# EAGLE design C128_Keyb_Test_SMD (EAGLE 9.6.2)
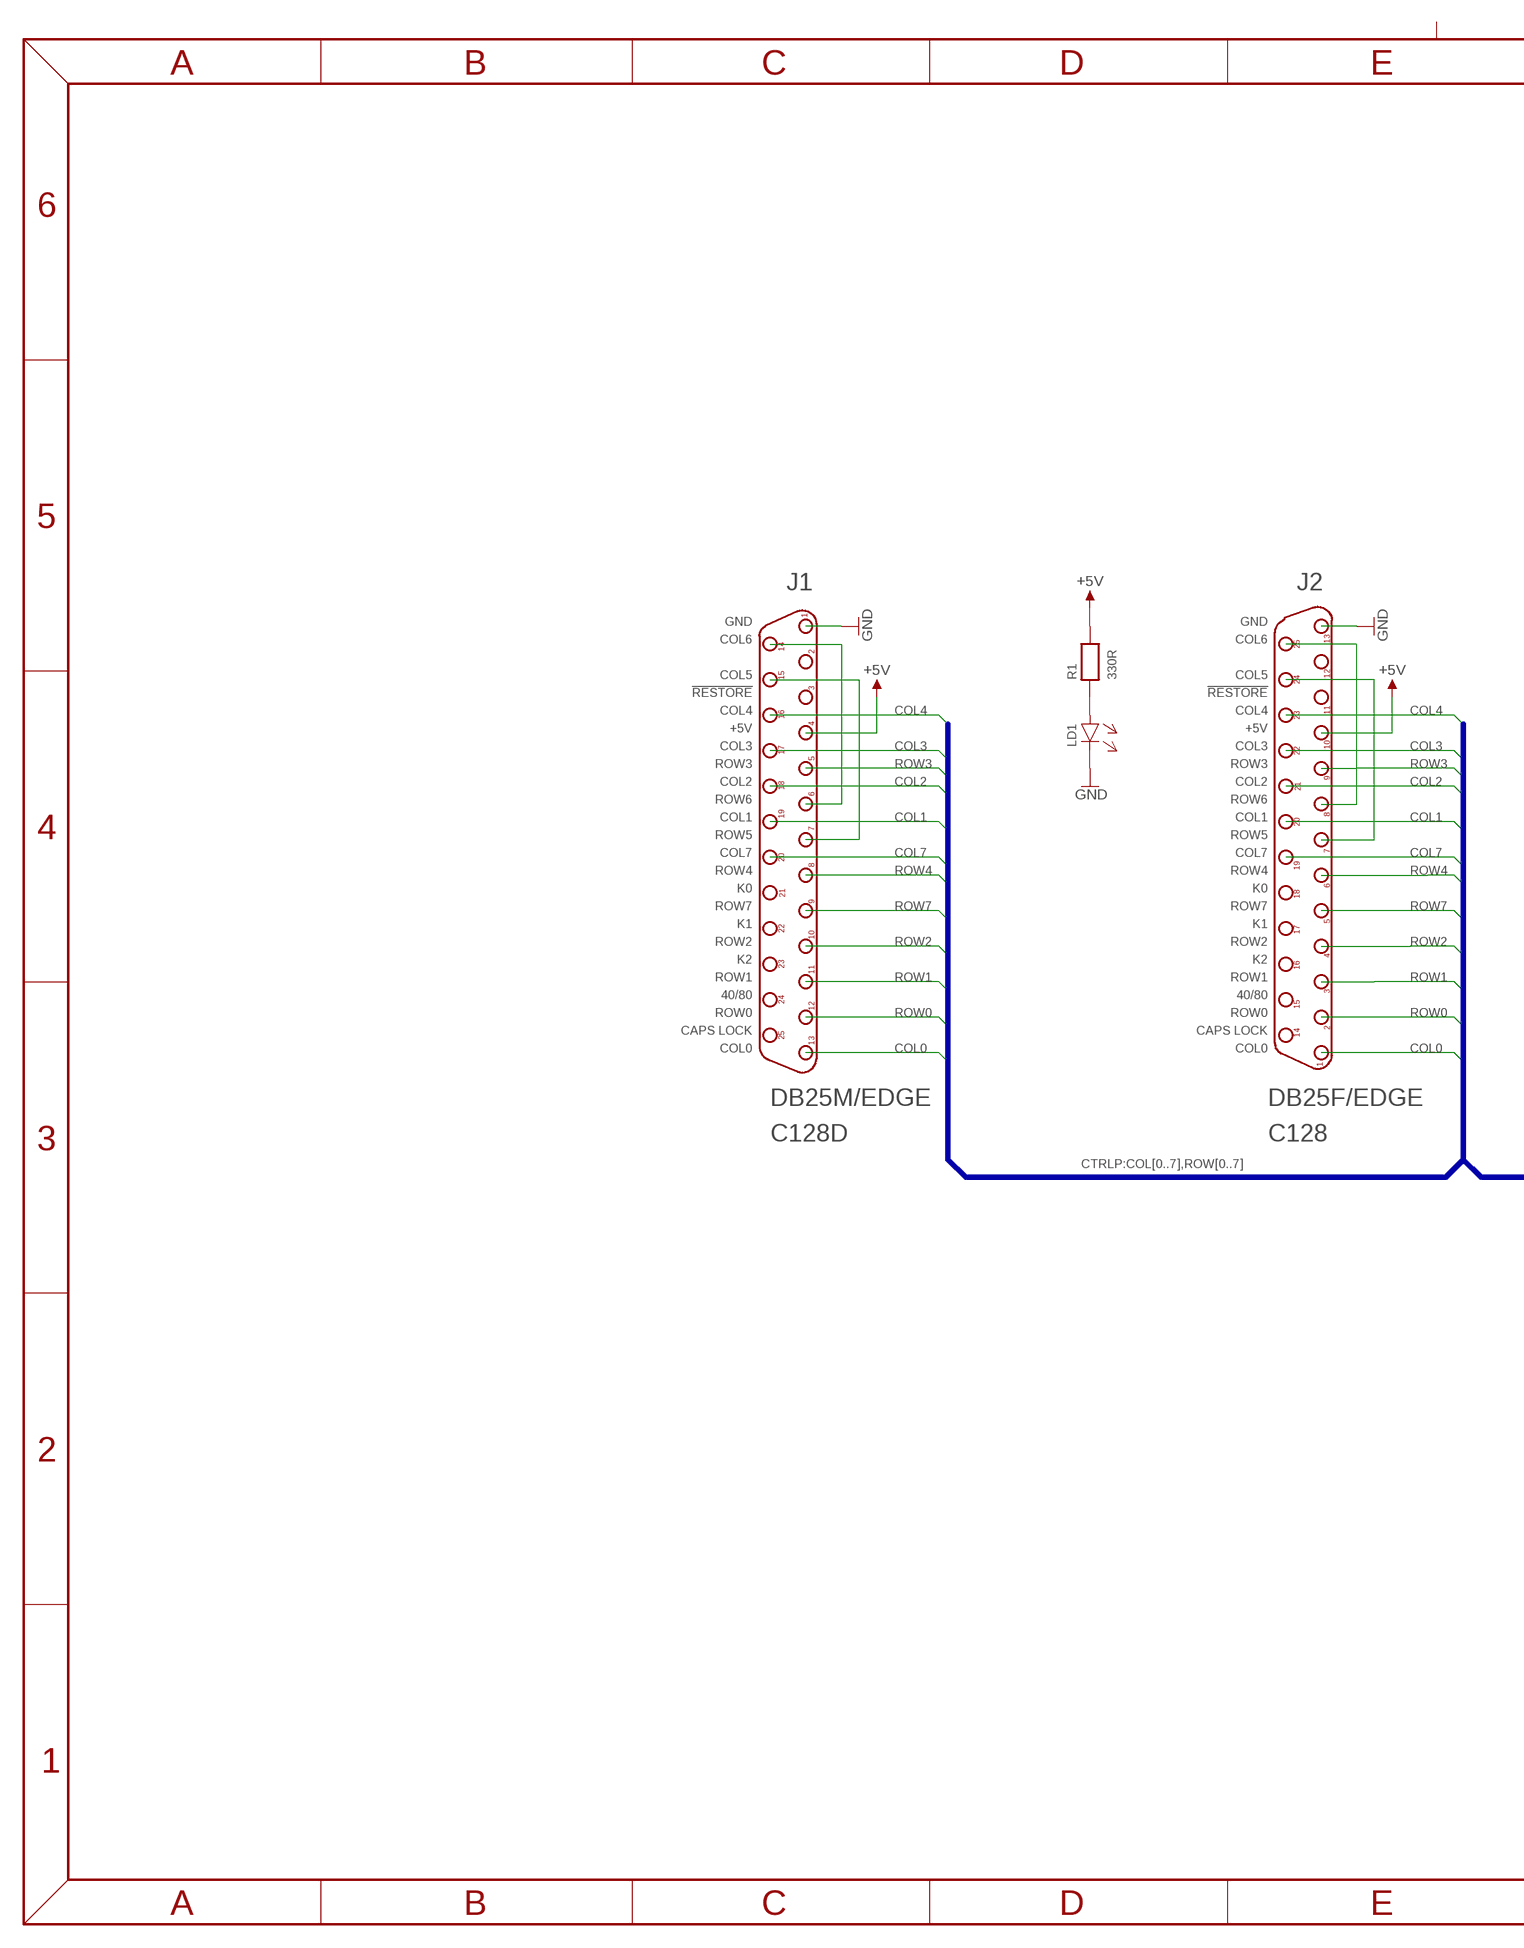
[diagram p0: schematic, sheet 1, part 1 of 2]
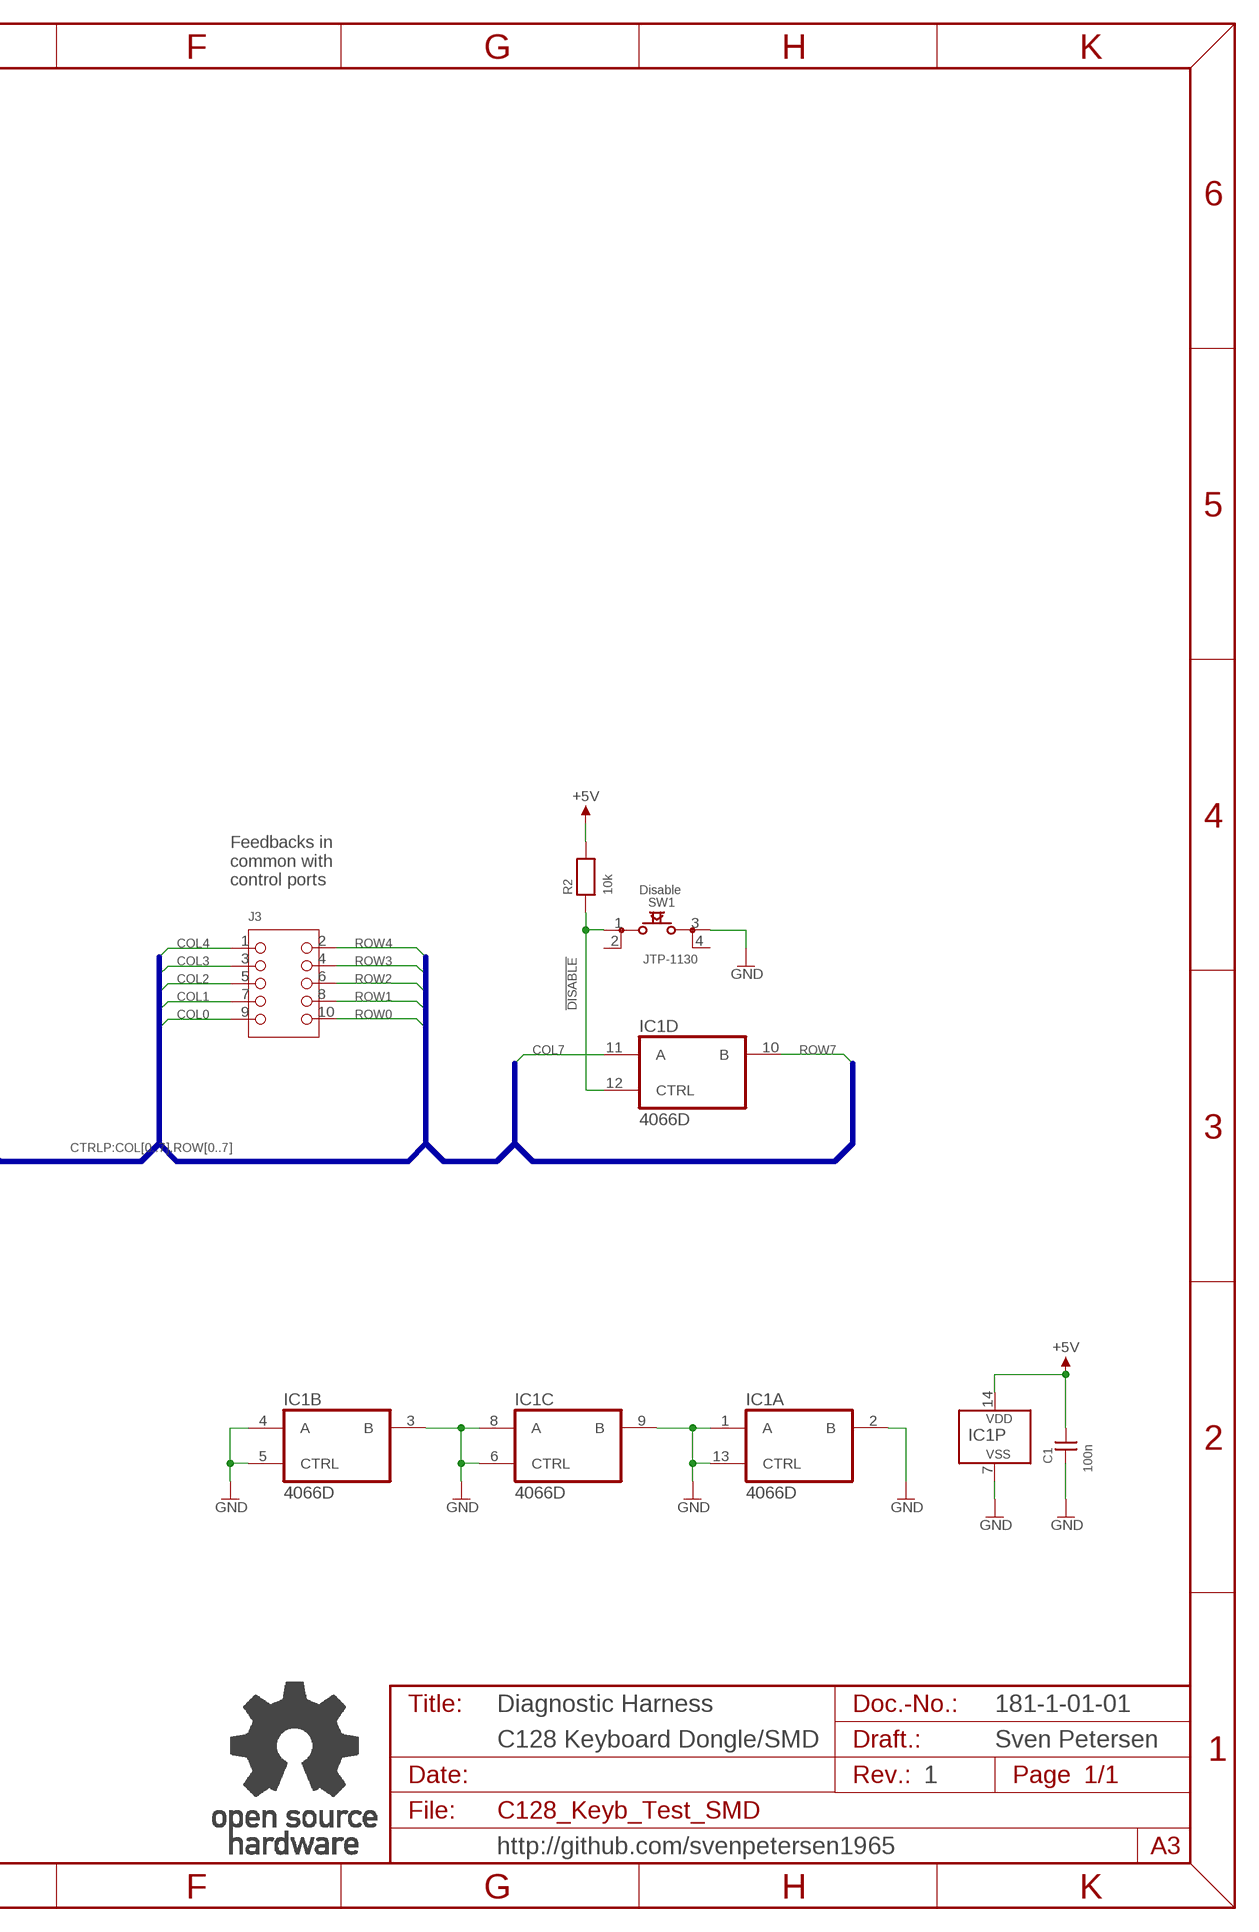
[diagram p1: schematic, sheet 1, part 2 of 2]

## Parts
C1  100n  CAP010805  [0805]
IC1  4066D  [SO14]
J1  DB25M/EDGE  [DB25M-EDGE]
J2  DB25F/EDGE  [DB25F-EDGE]
J3  2X05WV  [2X05WV]
LD1  3MM  [3MM]
R1  330R  RES040805  [0805]
R2  10k  RES040805  [0805]
SW1  JTP-1130  [JTP-1130]
U$20  OPEN_SOURCE_HW  [OPENHW]

## Nets
!DISABLE: IC1.12(D:CTRL) R2.1 SW1.1
+5V: C1.2 IC1.14(P:VDD) J1.4 J2.10 R1.2 R2.2
COL0: J1.13 J2.1 J3.9
COL1: J1.19 J2.20 J3.7
COL2: J1.18 J2.21 J3.5
COL3: J1.17 J2.22 J3.3
COL4: J1.16 J2.23 J3.1
COL7: IC1.11(D:A) J1.20 J2.19
GND: C1.1 IC1.1(A:A) IC1.2(A:B) IC1.3(B:B) IC1.4(B:A) IC1.5(B:CTRL) IC1.6(C:CTRL) IC1.7(P:VSS) IC1.8(C:A) IC1.9(C:B) IC1.13(A:CTRL) J1.1 J2.13 LD1.C(K) SW1.3
N$1: J1.6 J1.14
N$2: J1.7 J1.15
N$3: LD1.A R1.1
N$14: J2.7 J2.24
N$15: J2.8 J2.25
ROW0: J1.12 J2.2 J3.10
ROW1: J1.11 J2.3 J3.8
ROW2: J1.10 J2.4 J3.6
ROW3: J1.5 J2.9 J3.4
ROW4: J1.8 J2.6 J3.2
ROW7: IC1.10(D:B) J1.9 J2.5
Unconnected: J1.2 J1.3 J1.21 J1.22 J1.23 J1.24 J1.25 J2.11 J2.12 J2.14 J2.15 J2.16 J2.17 J2.18 SW1.2 SW1.4

## Buses
CTRLP:COL[0..7],ROW[0..7]

## Notes on the sheet
- GND | GND
- COL6 | COL6
- COL5 | COL5
- !RESTORE | !RESTORE
- COL4 | COL4
- +5V | +5V
- COL3 | COL3
- ROW3 | ROW3
- COL2 | COL2
- ROW6 | ROW6
- COL1 | COL1
- ROW5 | ROW5
- COL7 | COL7
- ROW4 | ROW4
- K0 | K0
- Feedbacks in
  common with
  control ports
- ROW7 | ROW7 | Disable
- K1 | K1
- ROW2 | ROW2
- K2 | K2
- ROW1 | ROW1
- 40/80 | 40/80
- ROW0 | ROW0
- CAPS LOCK | CAPS LOCK
- COL0 | COL0
- C128D | C128
- Diagnostic Harness | 181-1-01-01
- C128 Keyboard Dongle/SMD | Sven Petersen
- 1
- http://github.com/svenpetersen1965

## Library data of the parts
C1 = DISCRETE:CAP01
IC1 = 40xx:4066: Quad bilateral ANALOG SWITCH
J1 = Connect:DB25M/EDGE
J2 = Connect:DB25F/EDGE
J3 = PINHEAD:2X05WV
LD1 = LED:3MM
R1 R2 = DISCRETE:RES04
SW1 = Namae_Electronics:JTP-1130
U$20 = Logo:OPEN_SOURCE_HW

## Board
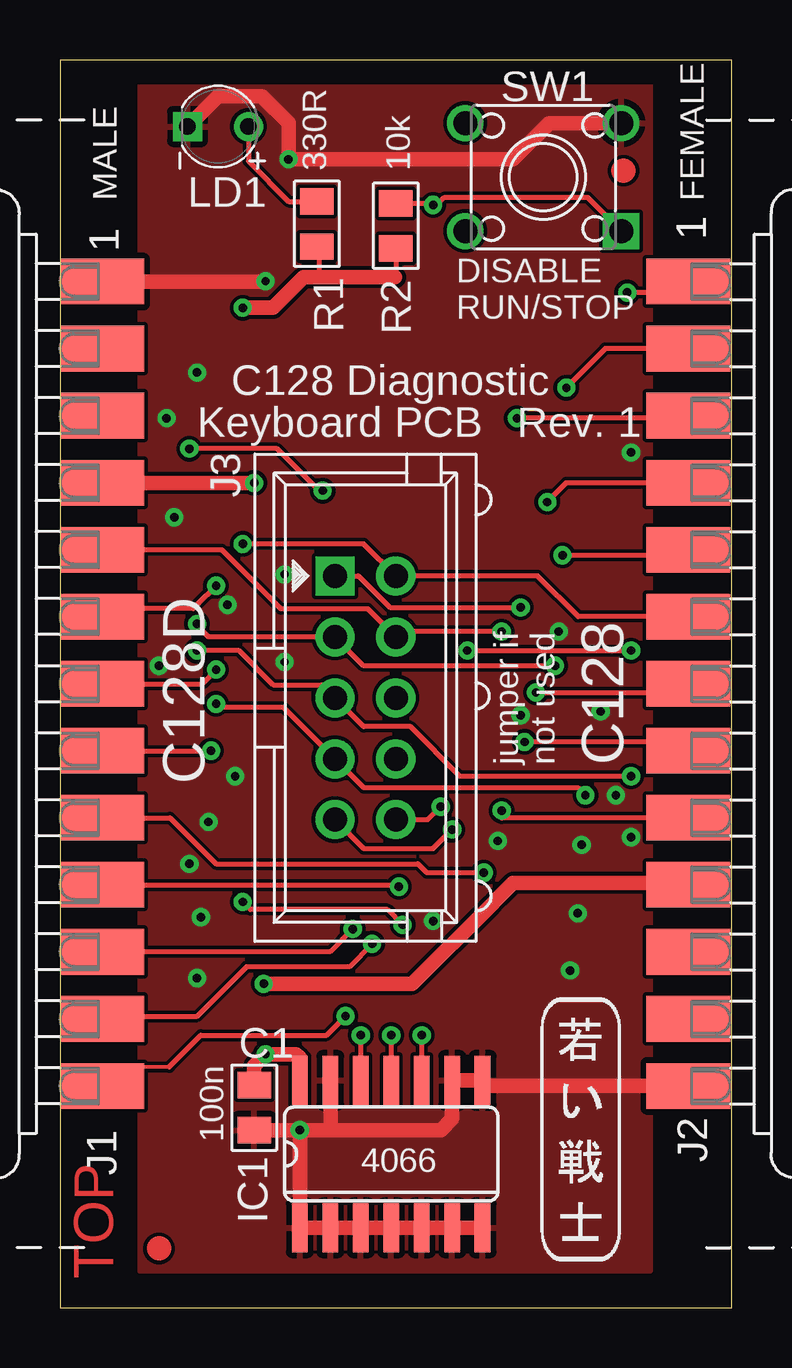
[diagram p2: board, top side]
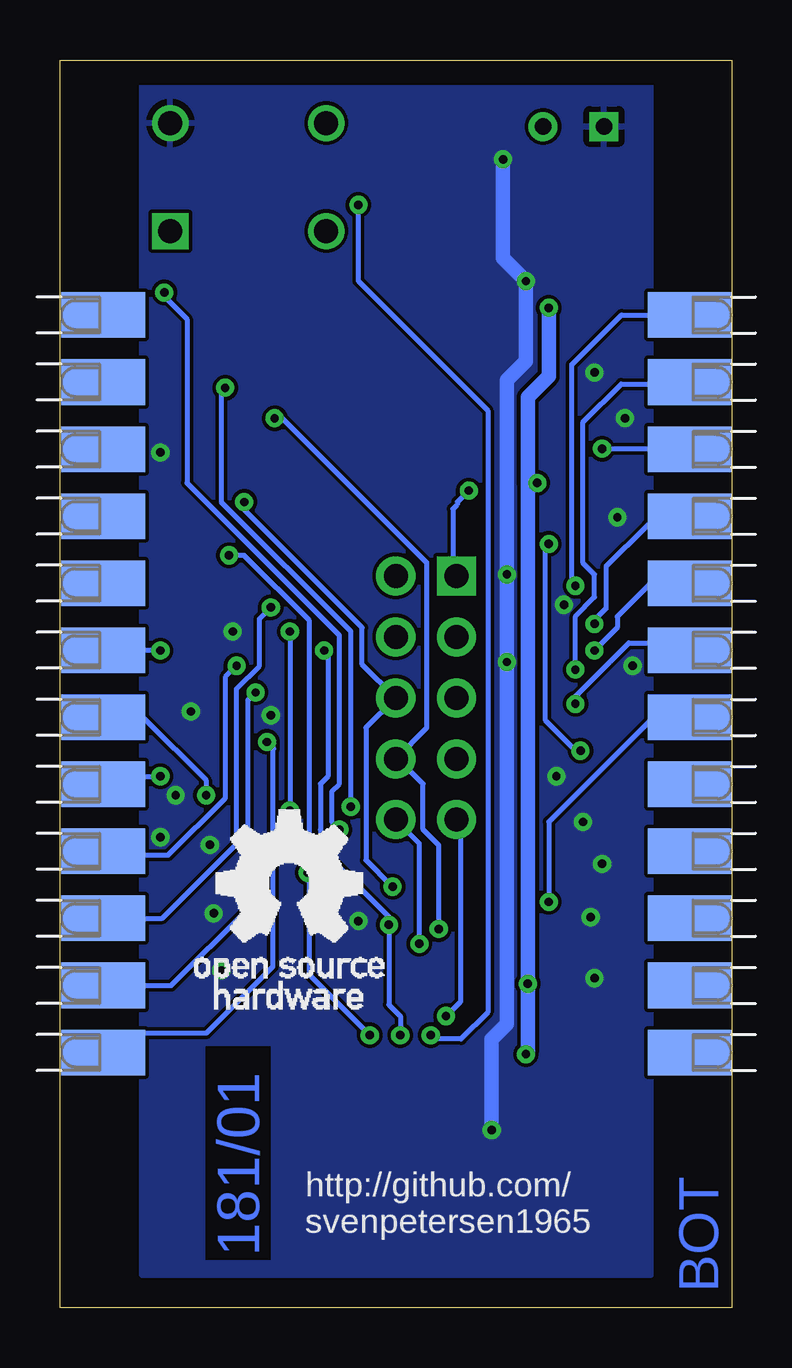
[diagram p3: board, bottom side, seen from below]

Size 28 x 52 mm. Coordinates in mm from the lower left corner, seen from the top.
Outline: 0,0 28,0 28,52 0,52 0,0
Copper layers (1*16): Top 0.035mm / dielectric 1.5mm / Bottom 0.035mm
Design rules "default *": minimum track width 6mil, minimum drill 0.35mm, track to track 6mil, track to pad 6mil, pad to pad 6mil, via to via 6mil, smd to smd 6mil, copper to edge 40mil, drill to drill 6mil, minimum pad ring 10mil, minimum via ring 8mil, stop-mask expansion 4mil, vias tented up to drill 25mil, thermal gap 10mil
bRestrict: 4 lines

### Footprints (pad centres in the part's own frame; a part is rotated, then mirrored left to right if it is on the bottom)
0805 = smd 1.092 x 1.397: 1 -0.94,0; 2 0.94,0
SO14 = smd 0.66 x 2.032: 1 -3.81,-3.073; 2 -2.54,-3.073; 3 -1.27,-3.073; 4 0,-3.073; 5 1.27,-3.073; 6 2.54,-3.073; 7 3.81,-3.073; 8 3.81,3.073; 9 2.54,3.073; 10 1.27,3.073; 11 0,3.073; 12 -1.27,3.073; 13 -2.54,3.073; 14 -3.81,3.073
DB25M-EDGE = smd 1.9 x 3.5: 1 -16.764,1.75; 2 -13.97,1.75; 3 -11.176,1.75; 4 -8.382,1.75; 5 -5.588,1.75; 6 -2.794,1.75; 7 0,1.75; 8 2.794,1.75; 9 5.588,1.75; 10 8.382,1.75; 11 11.176,1.75; 12 13.97,1.75; 13 16.764,1.75 | smd 1.9 x 3.5 bottom: 14 -15.367,1.75; 15 -12.573,1.75; 16 -9.779,1.75; 17 -6.985,1.75; 18 -4.191,1.75; 19 -1.397,1.75; 20 1.397,1.75; 21 4.191,1.75; 22 6.985,1.75; 23 9.779,1.75; 24 12.573,1.75; 25 15.367,1.75
DB25F-EDGE = smd 1.9 x 3.5: 1 16.764,1.8; 2 13.97,1.8; 3 11.176,1.8; 4 8.382,1.8; 5 5.588,1.8; 6 2.794,1.8; 7 0,1.8; 8 -2.794,1.8; 9 -5.588,1.8; 10 -8.382,1.8; 11 -11.176,1.8; 12 -13.97,1.8; 13 -16.764,1.8 | smd 1.9 x 3.5 bottom: 14 15.367,1.8; 15 12.573,1.8; 16 9.779,1.8; 17 6.985,1.8; 18 4.191,1.8; 19 1.397,1.8; 20 -1.397,1.8; 21 -4.191,1.8; 22 -6.985,1.8; 23 -9.779,1.8; 24 -12.573,1.8; 25 -15.367,1.8
2X05WV = drill 1 pad 1.626 square: 1 -5.08,-1.27 | drill 1 pad 1.626: 2 -5.08,1.27; 3 -2.54,-1.27; 4 -2.54,1.27; 5 0,-1.27; 6 0,1.27; 7 2.54,-1.27; 8 2.54,1.27; 9 5.08,-1.27; 10 5.08,1.27
3MM = drill 0.7: A -1.27,0 | drill 0.7 square: C 1.27,0
JTP-1130 = drill 1 square: 1 3.25,-2.25 | drill 1: 2 -3.25,-2.25; 3 3.25,2.25; 4 -3.25,2.25

### Placement (x,y rotation side)
C1  8.1,8.33 90 top
IC1  13.81,6.4 0 top
J1  0,26 270 top
J2  28,26 90 top
J3  12.73,25.41 270 top
LD1  6.58,49.23 180 top
R1  10.71,45.16 270 top
R2  14.01,45.08 270 top
SW1  20.15,47.12 0 top
U$8  [2LAYER]  2.22,1.19 90 top
U$9  [PCB-TITLE/]  0,58.18 0 top  (outside the outline)
U$10  [SVEN_TAG]  21.75,7.54 0 top
U$20  22.38,12.46 0 bottom
U$21  [SMD_REF_R1MM]  4.13,2.46 0 top
U$22  [SMD_REF_R1MM]  23.5,47.39 0 top

### Tracks (layer width: path | path; a pad name or v marks a point on that pad's centre or on a via)
!DISABLE  (via drill 0.35)
  Top 0.203: SW1.1 21.99,46.27 16.03,46.27 15.72,45.96 v15.56,45.96 15.49,46.02 R2.1 | v12.54,11.35 IC1.12
  Bottom 0.203: v15.56,45.96 15.56,42.78 10.16,37.38 10.16,12.3 11.27,11.19 12.38,11.19 v12.54,11.35
+5V  (via drill 0.35)
  Top 0.203: J1.4 2.05,34.38 2.06,34.37 | J2.10 25.32,17.62 25.24,17.7 | R1.2 10.79,44.14 10.79,42.94 | R2.2 14.01,42.98 13.97,42.94
  Top 0.61: v8.1,34.37 2.06,34.37 | 25.24,17.7 18.89,17.7 18.26,17.06 17.94,16.75 14.68,13.49 9.28,13.49 v8.49,13.49 | 13.97,42.94 10.79,42.94 10.16,42.94 8.89,41.67 v7.62,41.67 | IC1.14 10,10.4 9.84,10.56 v8.57,10.56 8.1,10.08 C1.2
  Bottom 0.61: 8.49,34.37 v8.49,13.49 8.49,10.64 v8.57,10.56 | 8.49,34.37 v8.1,34.37 | v7.62,41.67 7.62,38.81 8.49,37.94 8.49,34.37
COL0  (via drill 0.35)
  Top 0.152: 2.59,10.03 4.55,10.03
  Top 0.203: 2.59,10.03 2.04,10.03 J1.13 | J3.9 12.66,19.13 15.56,19.13 v16.35,19.92 | J2.1 26.86,42.76 26.4,42.31 v23.65,42.31 | v11.91,12.14 11.11,11.35 5.87,11.35 4.55,10.03
  Bottom 0.203: J3.9 11.3,20.18 11.3,12.75 v11.91,12.14 | v16.35,19.92 16.67,20.24 16.67,21.51 16.35,21.83 16.35,28.02 22.7,34.37 22.7,41.2 23.65,42.15 v23.65,42.31
COL1  (via drill 0.35)
  Top 0.203: v6.51,25.16 6.67,25 9.33,25 J3.7 12.66,21.67 21.59,21.67 v21.91,21.35
  Bottom 0.203: J1.19 1.8,27.7 4.29,27.7 5.08,26.91 6.51,25.48 v6.51,25.16 | J2.20 24.52,24.6 21.91,21.99 v21.91,21.35
COL2  (via drill 0.35)
  Top 0.203: v23.81,22.14 16.67,22.14 14.61,24.21 12.66,24.21 J3.5 10.92,25.95 8.89,25.95 7.46,27.38 v5.71,27.38
  Bottom 0.203: J2.21 26.18,21.56 25.59,22.14 v23.81,22.14 | J1.18 3.37,30.19 4.76,28.8 4.76,28.34 v5.71,27.38
COL3  (via drill 0.35)
  Top 0.203: v20.64,26.75 12.66,26.75 J3.3 6.19,27.95 5.71,28.43 v5.71,28.5
  Bottom 0.203: v20.64,26.75 21.11,26.27 21.11,21.22 23.48,18.86 26.29,18.86 J2.22 | J1.17 2.65,32.98 3.02,32.62 3.49,32.62 5.24,30.88 5.24,29.13 5.71,28.65 v5.71,28.5
COL4  (via drill 0.35)
  Top 0.203: v10.95,34.05 10.79,34.21 10.64,34.21 9.05,35.8 v5.4,35.8 | J3.1 12.45,30.49 13.02,29.92 13.76,29.18 v19.21,29.18
  Bottom 0.203: v10.95,34.05 11.43,33.58 11.43,33.48 11.62,33.29 11.62,30.65 J3.1 | v5.4,35.8 1.27,35.8 J1.16 | J2.23 23.73,16.22 20.64,19.32 20.64,25.8 19.68,26.75 19.68,28.7 v19.21,29.18
COL7  (via drill 0.35)
  Top 0.203: v14.29,15.95 13.65,16.59 7.94,16.59 v7.62,16.91 | v16.99,27.38 v23.81,27.38 | v13.81,11.35 IC1.11
  Bottom 0.203: J1.20 3.26,24.6 5.24,22.62 7.62,20.24 v7.62,16.91 | v16.99,27.38 16.83,27.23 16.83,22.14 17.14,21.83 17.14,19.92 17.14,19.13 14.29,16.27 v14.29,15.95 14.29,12.62 13.81,12.14 v13.81,11.35 | v23.81,27.38 26.69,27.38 J2.19
GND  (via drill 0.35)
  Top 0.203: J2.13 26.24,9.28
  Top 0.61: IC1.7 IC1.6 IC1.5 IC1.4 IC1.3 IC1.2 IC1.1 v10,7.39 | J1.1 8.55,42.76 v8.57,42.78 | SW1.3 20.4,49.37 18.89,47.86 v9.53,47.86 9.53,49.38 8.41,50.5 6.58,50.5 LD1.C | J2.13 17.86,9.24 IC1.8 IC1.9 16.35,7.86 15.88,7.38 11.27,7.38 | 11.27,7.38 IC1.13 | C1.1 v10,7.39 | v10,7.39 11.26,7.39 11.27,7.38
  Bottom 0.61: v9.53,47.86 9.53,43.73 v8.57,42.78 8.57,39.45 9.37,38.66 9.37,11.83 10.01,11.18 10.01,7.38
  other vias: 6.19,20.24 7.3,22.14 5.71,38.97 21.27,14.05 21.59,16.43 18.26,19.45 22.54,24.84 21.75,19.29 19.21,24.68 9.37,30.56 9.37,26.91 5.87,16.27 5.71,13.73 5.4,18.49 15.56,16.11 4.45,37.07 4.76,32.94 20.8,28.18 4.13,26.75 6.99,29.29 23.81,19.61 23.18,21.35 23.81,35.64
  pour Top: 3.33,51.12 24.61,51.12 24.61,1.51 3.33,1.51
  pour Bottom: 3.33,51.12 24.61,51.12 24.61,1.35 3.33,1.35
N$1  (via drill 0.35)
  Top 0.203: J1.6 1.59,29.13 2.7,29.13 5.56,29.13 6.67,30.24 v6.51,30.08
  Bottom 0.203: v6.51,30.08 6.67,30.24 6.67,39.29 4.59,41.37 J1.14
N$2  (via drill 0.35)
  Top 0.203: v6.51,26.59 5.92,26 J1.7
  Bottom 0.203: J1.15 1.33,38.5 4.6,38.5 6.19,36.91 6.19,31.04 5.71,30.56 5.71,29.61 6.51,28.81 v6.51,26.59
N$3
  Top 0.203: LD1.A 7.86,47.79 9.54,46.1 R1.1
N$14  (via drill 0.35)
  Top 0.203: v19.84,25.64 26.34,25.64 J2.7
  Bottom 0.203: v19.84,25.64 20.16,25.32 20.16,16.62 23.35,13.43 J2.24
N$15  (via drill 0.35)
  Top 0.203: v19.37,23.57 26.33,23.57 J2.8
  Bottom 0.203: J2.25 25.9,11.43 21.9,11.43 19.12,14.21 19.12,23.26 19.09,23.29 v19.37,23.57
ROW0  (via drill 0.35)
  Top 0.203: J1.12 1.36,12.14 5.71,12.14 7.78,14.21 12.06,14.21 v13.02,15.16 | J3.10 15.33,20.33 v15.88,20.88 | v21.11,38.34 21.11,38.35 22.73,39.97 J2.2
  Bottom 0.203: v13.02,15.16 13.02,19.35 J3.10 | v15.88,20.88 15.88,26.43 15.88,28.18 21.27,33.58 21.27,38.18 v21.11,38.34
ROW1  (via drill 0.35)
  Top 0.203: v12.21,15.78 11.25,14.82 J1.11 | J2.3 26.59,37.07 v19.05,37.07
  Bottom 0.203: v12.21,15.78 12.21,19.27 12.86,19.92 12.86,21.83 13.9,22.87 J3.8 12.7,24.17 12.7,31.04 18.73,37.07 v19.05,37.07
ROW2  (via drill 0.35)
  Top 0.203: J1.10 14.05,17.62 v14.13,17.54 | v20.32,33.58 20.32,33.59 21.11,34.38 J2.4
  Bottom 0.203: v20.32,33.58 20.32,33.26 15.4,28.34 15.4,26.81 J3.6 15.24,24.17 15.24,18.65 v14.13,17.54
ROW3  (via drill 0.35)
  Top 0.203: J1.5 6.75,31.59 9.21,29.13 12.82,29.13 J3.4 14.22,28.18 v18.41,28.18 | v18.41,20.72 18.41,20.4 26.69,20.4 J2.9
  Bottom 0.203: v18.41,28.18 v18.41,20.72
ROW4  (via drill 0.35)
  Top 0.203: J2.6 21.61,28.79 19.91,30.49 J3.2 12.66,31.83 v7.62,31.83 | J1.8 v6.3,23.21
  Bottom 0.203: v7.62,31.83 7.78,31.67 7.78,24.49 6.49,23.21 v6.3,23.21
ROW7  (via drill 0.35)
  Top 0.203: J1.9 4.59,20.41 6.51,18.49 14.92,18.49 15.29,18.13 v17.67,18.13 | J2.5 26.46,31.35 v20.95,31.35 | v15.08,11.35 IC1.10
  Bottom 0.203: 17.62,18.18 v17.67,18.13 | 17.62,18.18 17.62,28.65 20.32,31.35 v20.95,31.35 | v15.08,11.35 17.62,13.89 17.62,18.18

### Text on the board
Bottom: 181/01
tPlace: MALE | FEMALE | DISABLE / RUN/STOP | C128 Diagnostic | Keyboard PCB | Rev. 1 | jumper if / not used | C128 | C128D
bPlace: http://github.com/ / svenpetersen1965
tNames: 330R | 10k | 100n | 4066
Document: 181-2-01-01 | Sven Petersen / 2020 | 35µ | 2 | 1